# Altium project UZ_CarrierBoard.PrjPcb (part 8 of 10)

## Sheet S3C_IOs3V3.SchDoc
size A4; Organization: UltraZohm; SheetNumber: 9
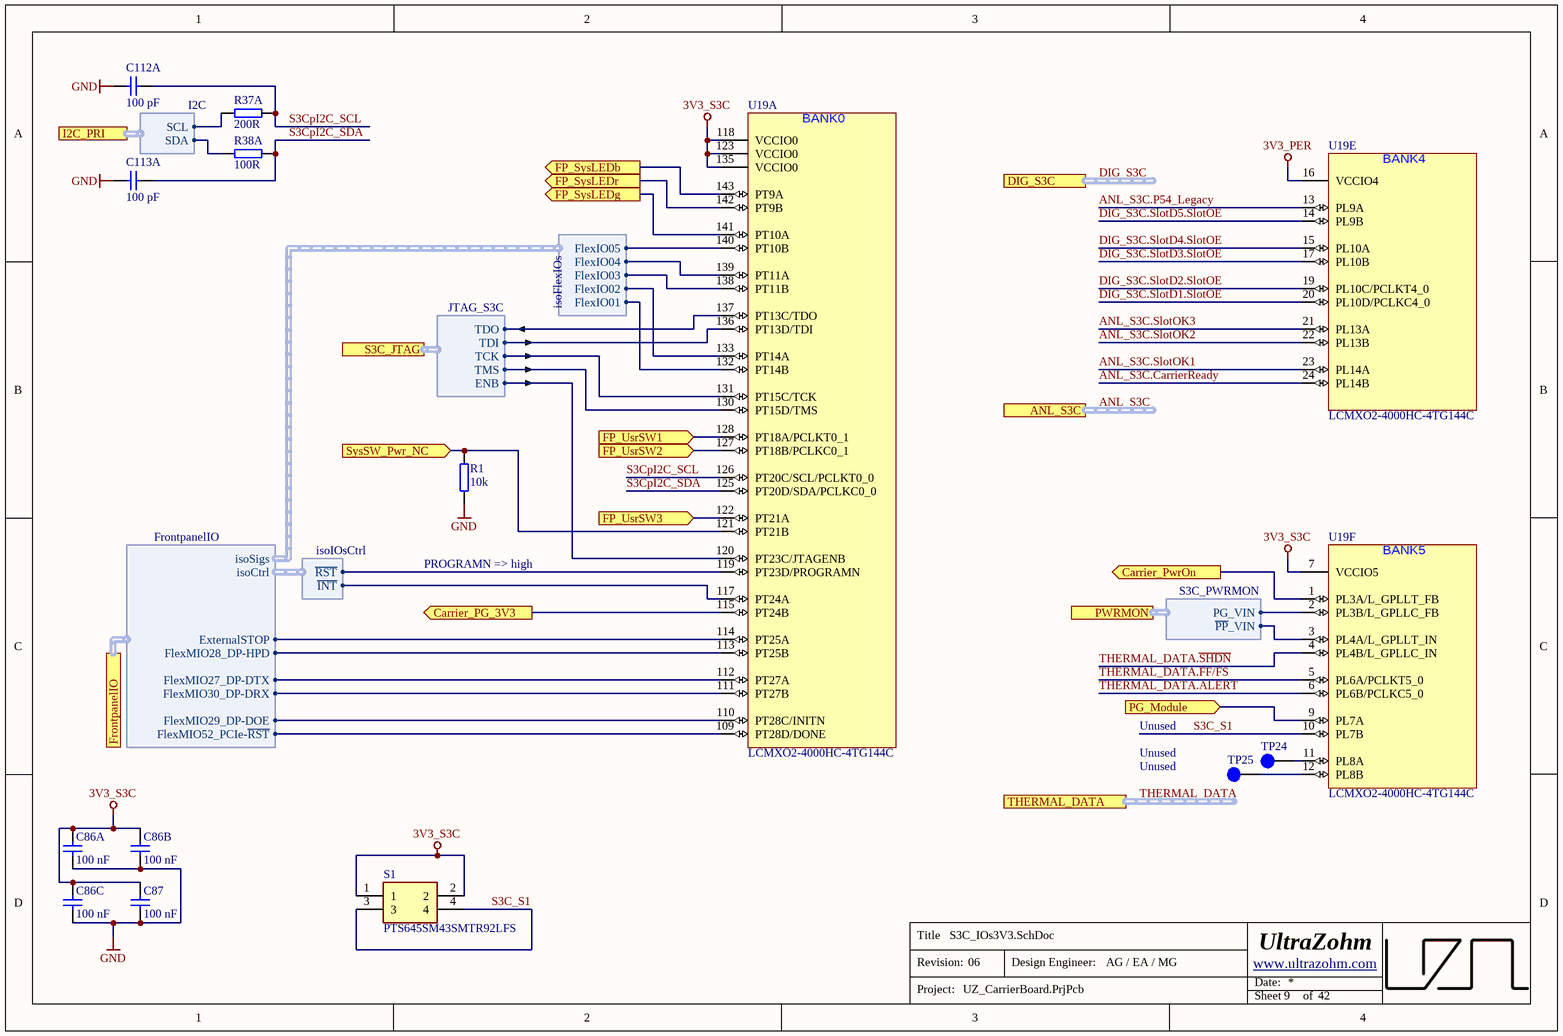
[diagram p29: S3C_IOs3V3.SchDoc]

### Parts
C86A  100 nF  [C_0603_TE]
C86B  100 nF  [C_0603_TE]
C86C  100 nF  [C_0603_TE]
C87  100 nF  [C_0603_TE]
C112A  100 pF  [C_0603_TE]
C113A  100 pF  [C_0603_TE]
R1  10k  [R_0603_TE]
R37A  200R  [R_0603_TE]
R38A  100R  [R_0603_TE]
S1  PTS645SM43SMTR92LFS  [PTS645_SMT]
TP24  Testpoint 1mm  [TP_1mm]  (value not drawn)  (no BOM)
TP25  Testpoint 1mm  [TP_1mm]  (value not drawn)  (no BOM)
U19  LCMXO2-4000HC-4TG144C  [QFP50P2200X2200X160-144N]  (parts A,E,F of 7)

### Ports
ANL_S3C (harness ANL_S3C), Carrier_PG_3V3 (out), Carrier_PwrOn (out), DIG_S3C (harness DIG_S3C), FP_SysLEDb (out), FP_SysLEDg (out), FP_SysLEDr (out), FP_UsrSW1 (in), FP_UsrSW2 (in), FP_UsrSW3 (in), FrontpanelIO (harness FrontpanelIO), I2C_PRI (harness I2C), PG_Module (in), PWRMON (harness S3C_PWRMON), S3C_JTAG (harness JTAG_S3C), SysSW_Pwr_NC (in), THERMAL_DATA (harness T_DATA)

### Harnesses
JTAG_S3C: TDO, TDI, TCK, TMS, ENB
I2C: SCL, SDA
FrontpanelIO: FlexMIO27_DP-DTX, FlexMIO28_DP-HPD, FlexMIO29_DP-DOE, FlexMIO30_DP-DRX, FlexMIO52_PCIe-~{RST}, isoSigs, isoCtrl, ExternalSTOP
isoFlexIOs: FlexIO01, FlexIO02, FlexIO03, FlexIO04, FlexIO05
isoIOsCtrl: ~{RST}, ~{INT}
S3C_PWRMON: PG_VIN, ~{PP}_VIN

### Nets
3V3_PER: U19.16(VCCIO4)
3V3_S3C: C86A.2 C86B.2 C86C.2 C87.2 S1.1 S1.2 U19.7(VCCIO5) U19.118(VCCIO0) U19.123(VCCIO0) U19.135(VCCIO0)
GND: C86A.1 C86B.1 C86C.1 C87.1 C112A.2 C113A.2 R1.1
ANL_S3C.CarrierReady: U19.24(PL14B)
ANL_S3C.P54_Legacy: U19.13(PL9A)
ANL_S3C.SlotOK1: U19.23(PL14A)
ANL_S3C.SlotOK2: U19.22(PL13B)
ANL_S3C.SlotOK3: U19.21(PL13A)
Carrier_PG_3V3: U19.115(PT24B) ; port Carrier_PG_3V3
Carrier_PwrOn: U19.1(PL3A/L_GPLLT_FB) ; port Carrier_PwrOn
DIG_S3C.SlotD1.SlotOE: U19.20(PL10D/PCLKC4_0)
DIG_S3C.SlotD2.SlotOE: U19.19(PL10C/PCLKT4_0)
DIG_S3C.SlotD3.SlotOE: U19.17(PL10B)
DIG_S3C.SlotD4.SlotOE: U19.15(PL10A)
DIG_S3C.SlotD5.SlotOE: U19.14(PL9B)
FP_SysLEDb: U19.143(PT9A) ; port FP_SysLEDb
FP_SysLEDg: U19.141(PT10A) ; port FP_SysLEDg
FP_SysLEDr: U19.142(PT9B) ; port FP_SysLEDr
FP_UsrSW1: U19.128(PT18A/PCLKT0_1) ; port FP_UsrSW1
FP_UsrSW2: U19.127(PT18B/PCLKC0_1) ; port FP_UsrSW2
FP_UsrSW3: U19.122(PT21A) ; port FP_UsrSW3
PG/~{ALERT}: U19.2(PL3B/L_GPLLC_FB) ; port PWRMON.PG_VIN
PG/~{ALERT}: U19.3(PL4A/L_GPLLT_IN) ; port PWRMON.~{PP}_VIN  [a separate net that carries the same name]
PG_Module: U19.9(PL7A) ; port PG_Module
S3C_S1: S1.3 S1.4 U19.10(PL7B)
S3CpI2C_SCL: C112A.1 R37A.2 U19.126(PT20C/SCL/PCLKT0_0)
S3CpI2C_SDA: C113A.1 R38A.2 U19.125(PT20D/SDA/PCLKC0_0)
SysSW_Pwr_NC: R1.2 U19.121(PT21B) ; port SysSW_Pwr_NC
THERMAL_DATA.~{ALERT}: U19.6(PL6B/PCLKC5_0)
THERMAL_DATA.~{FF/FS}: U19.5(PL6A/PCLKT5_0)
THERMAL_DATA.~{SHDN}: U19.4(PL4B/L_GPLLC_IN)
NetR37A_1: R37A.1 ; port I2C_PRI.SCL
NetR38A_1: R38A.1 ; port I2C_PRI.SDA
NetTP24_1: TP24.1 U19.11(PL8A)
NetTP25_1: TP25.1 U19.12(PL8B)
NetU19_114: U19.114(PT25A) ; port FrontpanelIO.ExternalSTOP
NetU19_117: U19.117(PT24A) ; harness isoIOsCtrl.~{INT}
NetU19_119: U19.119(PT23D/PROGRAMN) ; harness isoIOsCtrl.~{RST}
NetU19_120: U19.120(PT23C/JTAGENB) ; port S3C_JTAG.ENB
NetU19_130: U19.130(PT15D/TMS) ; port S3C_JTAG.TMS
NetU19_131: U19.131(PT15C/TCK) ; port S3C_JTAG.TCK
NetU19_132: U19.132(PT14B) ; harness isoFlexIOs.FlexIO01
NetU19_133: U19.133(PT14A) ; harness isoFlexIOs.FlexIO02
NetU19_136: U19.136(PT13D/TDI) ; port S3C_JTAG.TDI
NetU19_137: U19.137(PT13C/TDO) ; port S3C_JTAG.TDO
NetU19_138: U19.138(PT11B) ; harness isoFlexIOs.FlexIO03
NetU19_139: U19.139(PT11A) ; harness isoFlexIOs.FlexIO04
NetU19_140: U19.140(PT10B) ; harness isoFlexIOs.FlexIO05

Not connected (* = marked no-connect by the designer): U19 109(PT28D/DONE) 110(PT28C/INITN) 111(PT27B) 112(PT27A) 113(PT25B)

### Buses and harness runs
harness ANL_S3C = port ANL_S3C
harness DIG_S3C = port DIG_S3C
harness THERMAL_DATA = port THERMAL_DATA

### Notes on the sheet
- PROGRAMN => high
- Unused
- Title
- Revision:
- Design Engineer:
- Date:
- Project:
- Sheet
- of
- (in symbol LCMXO2-4000HC-4TG144C, part A) BANK0
- (in symbol LCMXO2-4000HC-4TG144C, part E) BANK4
- (in symbol LCMXO2-4000HC-4TG144C, part F) BANK5

### Library data of the parts
C86A C86B C86C C87 = UZgen_C_0603_100nF_50V_X7R: as C103 on sheet S3C; Value: 100 nF; Technology: X7R; Manufacturer Part Number: UZgen_C_0603_100nF_50V_X7R; PartID: 1; Created On: 02/07/2024 14:42:23; Device Package: 0603; Mounting Type: SMD; Last Updated: 02/08/2024 14:45:57
C112A C113A = UZgen_C_0603_100pF_50V_X7R: Generic capacitor; Manufacturer: UZgen; Voltage: 50V; Tolerance: 10 %; Created from: UZgenTool; Manufacturer Part Number: UZgen_C_0603_100pF_50V_X7R; PartID: 4215; Created On: 02/08/2024 11:18:08; Value: 100 pF; Device Package: 0603; Technology: X7R; Mounting Type: SMD; Last Updated: 02/08/2024 11:18:08
R1 = UZgen_R_0603_10k: as R200 on sheet Power_Supply_TPS54260; Manufacturer Part Number: UZgen_R_0603_10k; PartID: 1; Created On: 02/07/2024 14:34:53; Value: 10k; Device Package: 0603; Mounting Type: SMD; Last Updated: 02/07/2024 14:37:16
R37A = UZgen_R_0603_200R: Generic resistor; Manufacturer: UZgen; Tolerance: 1 %; Created from: UZgenTool; Manufacturer Part Number: UZgen_R_0603_200R; PartID: 204; Created On: 02/07/2024 17:29:49; Value: 200R; Device Package: 0603; Mounting Type: SMD; Last Updated: 02/07/2024 17:29:49
R38A = UZgen_R_0603_100R: as R91 on sheet Power_Supply_1; Manufacturer Part Number: UZgen_R_0603_100R; PartID: 197; Created On: 02/07/2024 17:29:48; Value: 100R; Device Package: 0603; Mounting Type: SMD; Last Updated: 02/07/2024 17:29:48
S1 = PTS645SM43SMTR92LFS: 50mA SPST 160gf 12V SMD-4P,6x6mm Tactile Switches ROHS; Manufacturer_Name: C & K COMPONENTS; Manufacturer: C&K COMPONENTS; Value: Push Button; Created from: AGeiger; Datasheet Link: https://www.ckswitches.com/media/1471/pts645.pdf; Manufacturer_Part_Number: PTS645SM43SMTR92LFS; Mouser Part Number: 611-PTS645SM43SMTR92; Mouser Price/Stock: https://www.mouser.co.uk/ProductDetail/CK/PTS645SM43SMTR92LFS?qs=FESYatJ8odKPktxv6ncfWg%3D%3D; Arrow Part Number: PTS645SM43SMTR92LFS; Arrow Price/Stock: https://www.arrow.com/en/products/pts645sm43smtr92lfs/ck; Manufacturer Part Number: PTS645SM43SMTR92LFS; PartID: 24; Created On: 31/05/2023 15:31:02; ComponentLink1Description: Datasheet; ComponentLink1URL: https://datasheet.lcsc.com/lcsc/1810121628_C-K-PTS645SM43SMTR92LFS_C221880.pdf; Component Type: Tactile Switch; Device Package: SMD; Last Updated: 31/05/2023 15:31:02; Mounting Type: SMD; Operating Temperature: -20 to +60 °C; Supplier 1: Mouser; Supplier Part Number 1: 611-PTS645SM43SMTR92; Supplier 2: LCSC; Supplier Part Number 2: C221880; Type: Tactile Switch; Live Cycle Status: 1; LCSC Part Number: C221880
TP24 TP25 = NULL: as TP78 on sheet Power_Supply_TPS54260; Created: 2018_06_25_AGeiger; Value: Testpoint 1mm; PartID: 9; Created On: 20/09/2022 13:14:57; Component Type: Testpoint; Last Updated: 20/09/2022 13:15:39; Manufacturer: NULL; Supplier 1: NULL; Supplier Part Number 1: NULL; Type: Testpoint; Live Cycle Status: 1
U19 = LCMXO2-4000HC-4TG144C: as U19 on sheet S3C; Manufacturer Part Number: LCMXO2-4000HC-4TG144C; PartID: 38; Created On: 03/07/2024 17:33:36; ComponentLink1Description: Datasheet; ComponentLink1URL: https://wmsc.lcsc.com/wmsc/upload/file/pdf/v2/lcsc/2403111456_Lattice-LCMXO2-4000HC-4TG144C_C1521625.pdf; Component Type: CPLD; Device Package: TQFP-144; Last Updated: 23/08/2024 11:42:29; Mounting Type: SMD; Operating Temperature: -0 to +85 °C; Supplier 1: LCSC; Supplier Part Number 1: C1521625; Supplier 2: Mouser; Supplier Part Number 2: 842-XO24000HC4TG144C; Type: CPLD; Live Cycle Status: 1; LCSC Part Number: C1521625; Stock number: not stored

## Sheet S3C_IOs1V8.SchDoc
size A4; Organization: UltraZohm; SheetNumber: 10
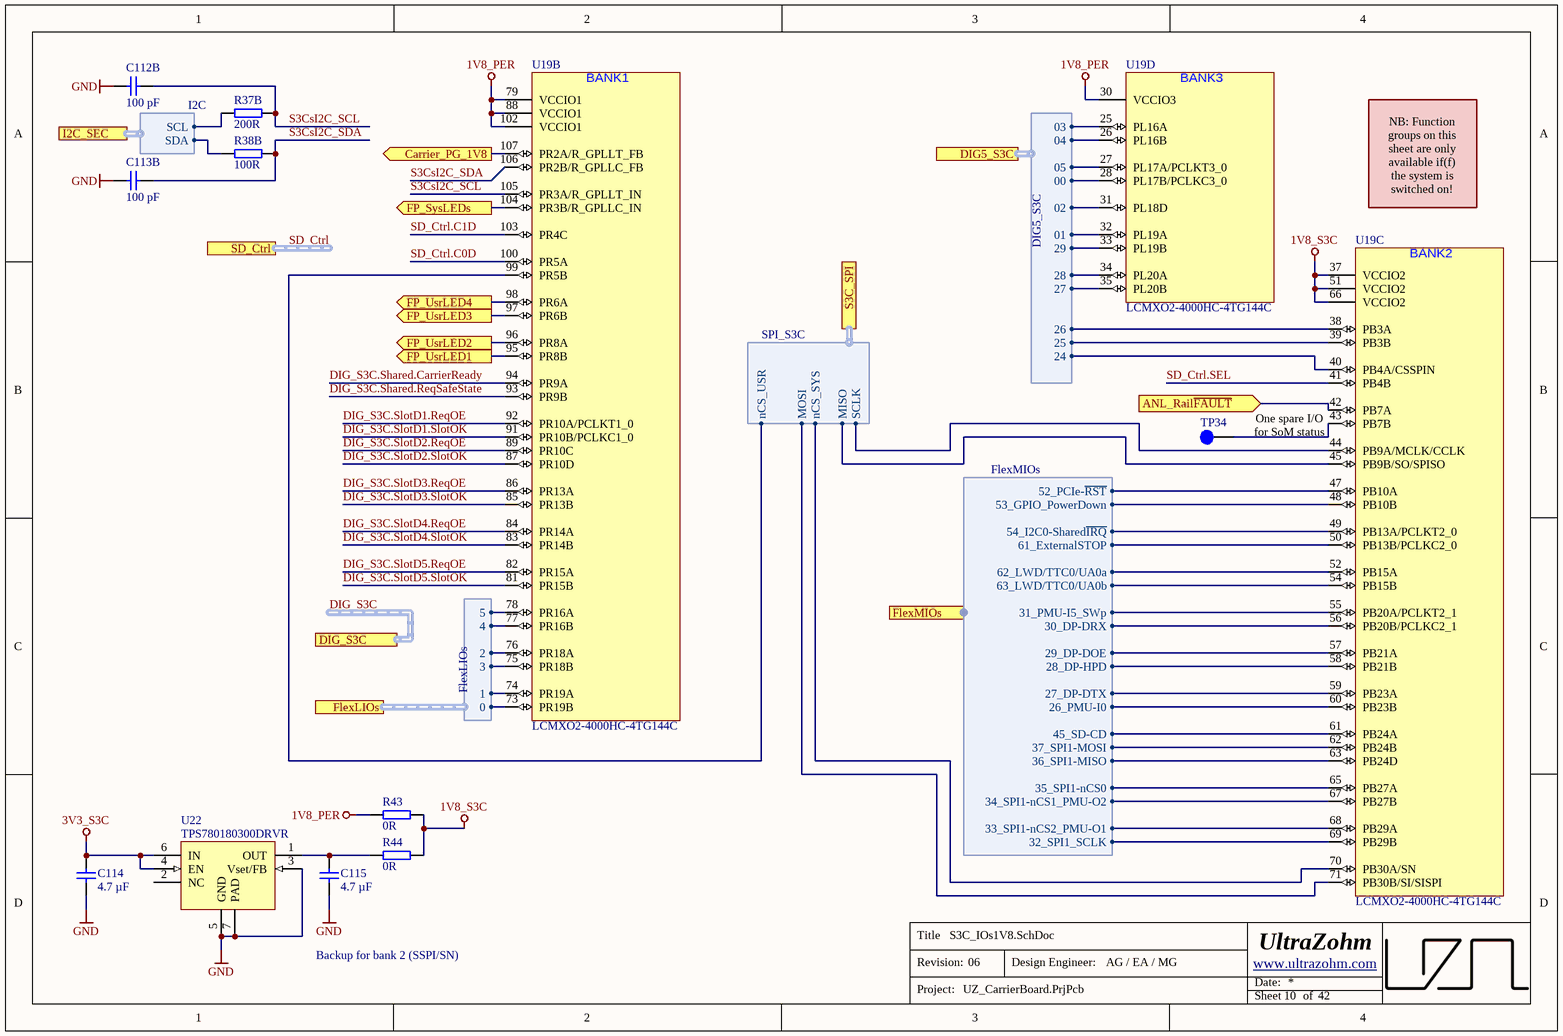
[diagram p30: S3C_IOs1V8.SchDoc]

### Parts
C112B  100 pF  [C_0603_TE]
C113B  100 pF  [C_0603_TE]
C114  4.7 µF  [C_0603_TE]
C115  4.7 µF  [C_0603_TE]
R37B  200R  [R_0603_TE]
R38B  100R  [R_0603_TE]
R43  0R  [R_1206_TE]
R44  0R  [R_1206_TE]
TP34  Testpoint 1mm  [TP_1mm]  (value not drawn)  (no BOM)
U19  LCMXO2-4000HC-4TG144C  [QFP50P2200X2200X160-144N]  (parts B,C,D of 7)
U22  TPS780180300DRVR  [SON65P200X200X80-7N]

### Ports
ANL_Rail~{FAULT} (in), Carrier_PG_1V8 (out), DIG5_S3C (harness DIG5_S3C), DIG_S3C (harness DIG_S3C), FlexLIOs (harness FlexLIOs), FlexMIOs (harness FlexMIOs), FP_SysLEDs (out), FP_UsrLED1 (out), FP_UsrLED2 (out), FP_UsrLED3 (out), FP_UsrLED4 (out), I2C_SEC (harness I2C), S3C_SPI (harness SPI_S3C), SD_Ctrl (harness SD_Ctrl)

### Harnesses
FlexMIOs: 26_PMU-I0, 27_DP-DTX, 28_DP-HPD, 29_DP-DOE, 30_DP-DRX, 31_PMU-I5_SWp, 32_SPI1_SCLK, 33_SPI1-nCS2_PMU-O1, 34_SPI1-nCS1_PMU-O2, 35_SPI1-nCS0, 36_SPI1-MISO, 37_SPI1-MOSI, 45_SD-CD, 52_PCIe-~{RST}, 53_GPIO_PowerDown, 54_I2C0-Shared~{IRQ}, 61_ExternalSTOP, 62_LWD/TTC0/UA0a, 63_LWD/TTC0/UA0b
DIG5_S3C: 00, 01, 02, 03, 04, 05, 24, 25, 26, 27, 28, 29
I2C: SCL, SDA
SPI_S3C: SCLK, MOSI, MISO, nCS_SYS, nCS_USR
FlexLIOs: 0, 1, 2, 3, 4, 5

### Nets
1V8_PER: R43.1 U19.30(VCCIO3) U19.79(VCCIO1) U19.88(VCCIO1) U19.102(VCCIO1)
1V8_S3C: R43.2 R44.2 U19.37(VCCIO2) U19.51(VCCIO2) U19.66(VCCIO2)
3V3_S3C: C114.2 U22.4(EN) U22.6(IN)
GND: C112B.2 C113B.2 C114.1 C115.1 U22.3(Vset/FB) U22.5(GND) U22.7(PAD)
ANL_Rail~{FAULT}: U19.42(PB7A) ; port ANL_Rail~{FAULT}
B64_T0: U19.73(PR19B) ; port FlexLIOs.0
B64_T1: U19.74(PR19A) ; port FlexLIOs.1
B64_T2: U19.76(PR18A) ; port FlexLIOs.2
B64_T3: U19.75(PR18B) ; port FlexLIOs.3
B66_L23_N: U19.78(PR16A) ; port FlexLIOs.5
B66_L23_P: U19.77(PR16B) ; port FlexLIOs.4
Carrier_PG_1V8: U19.107(PR2A/R_GPLLT_FB) ; port Carrier_PG_1V8
DIG_00_Ch5: U19.28(PL17B/PCLKC3_0) ; port DIG5_S3C.00
DIG_01_Ch5: U19.32(PL19A) ; port DIG5_S3C.01
DIG_02_Ch5: U19.31(PL18D) ; port DIG5_S3C.02
DIG_03_Ch5: U19.25(PL16A) ; port DIG5_S3C.03
DIG_04_Ch5: U19.26(PL16B) ; port DIG5_S3C.04
DIG_05_Ch5: U19.27(PL17A/PCLKT3_0) ; port DIG5_S3C.05
DIG_24_Ch5: U19.40(PB4A/CSSPIN) ; port DIG5_S3C.24
DIG_25_Ch5: U19.39(PB3B) ; port DIG5_S3C.25
DIG_26_Ch5: U19.38(PB3A) ; port DIG5_S3C.26
DIG_27_Ch5: U19.35(PL20B) ; port DIG5_S3C.27
DIG_28_Ch5: U19.34(PL20A) ; port DIG5_S3C.28
DIG_29_Ch5: U19.33(PL19B) ; port DIG5_S3C.29
DIG_S3C.Shared.CarrierReady: U19.94(PR9A)
DIG_S3C.Shared.ReqSafeState: U19.93(PR9B)
DIG_S3C.SlotD1.ReqOE: U19.92(PR10A/PCLKT1_0)
DIG_S3C.SlotD1.SlotOK: U19.91(PR10B/PCLKC1_0)
DIG_S3C.SlotD2.ReqOE: U19.89(PR10C)
DIG_S3C.SlotD2.SlotOK: U19.87(PR10D)
DIG_S3C.SlotD3.ReqOE: U19.86(PR13A)
DIG_S3C.SlotD3.SlotOK: U19.85(PR13B)
DIG_S3C.SlotD4.ReqOE: U19.84(PR14A)
DIG_S3C.SlotD4.SlotOK: U19.83(PR14B)
DIG_S3C.SlotD5.ReqOE: U19.82(PR15A)
DIG_S3C.SlotD5.SlotOK: U19.81(PR15B)
FlexMIOs.26_PMU-I0: U19.60(PB23B) ; port FlexMIOs.26_PMU-I0
FlexMIOs.27_DP-DTX: U19.59(PB23A) ; port FlexMIOs.27_DP-DTX
FlexMIOs.28_DP-HPD: U19.58(PB21B) ; port FlexMIOs.28_DP-HPD
FlexMIOs.29_DP-DOE: U19.57(PB21A) ; port FlexMIOs.29_DP-DOE
FlexMIOs.30_DP-DRX: U19.56(PB20B/PCLKC2_1) ; port FlexMIOs.30_DP-DRX
FlexMIOs.31_PMU-I5_SWp: U19.55(PB20A/PCLKT2_1) ; port FlexMIOs.31_PMU-I5_SWp
FlexMIOs.32_SPI1_SCLK: U19.69(PB29B) ; port FlexMIOs.32_SPI1_SCLK
FlexMIOs.33_SPI1-nCS2_PMU-O1: U19.68(PB29A) ; port FlexMIOs.33_SPI1-nCS2_PMU-O1
FlexMIOs.34_SPI1-nCS1_PMU-O2: U19.67(PB27B) ; port FlexMIOs.34_SPI1-nCS1_PMU-O2
FlexMIOs.35_SPI1-nCS0: U19.65(PB27A) ; port FlexMIOs.35_SPI1-nCS0
FlexMIOs.36_SPI1-MISO: U19.63(PB24D) ; port FlexMIOs.36_SPI1-MISO
FlexMIOs.37_SPI1-MOSI: U19.62(PB24B) ; port FlexMIOs.37_SPI1-MOSI
FlexMIOs.45_SD-CD: U19.61(PB24A) ; port FlexMIOs.45_SD-CD
FlexMIOs.52_PCIe-~{RST}: U19.47(PB10A) ; port FlexMIOs.52_PCIe-~{RST}
FlexMIOs.53_GPIO_PowerDown: U19.48(PB10B) ; port FlexMIOs.53_GPIO_PowerDown
FlexMIOs.54_I2C0-Shared~{IRQ}: U19.49(PB13A/PCLKT2_0) ; port FlexMIOs.54_I2C0-Shared~{IRQ}
FlexMIOs.61_ExternalSTOP: U19.50(PB13B/PCLKC2_0) ; port FlexMIOs.61_ExternalSTOP
FlexMIOs.62_LWD/TTC0/UA0a: U19.52(PB15A) ; port FlexMIOs.62_LWD/TTC0/UA0a
FlexMIOs.63_LWD/TTC0/UA0b: U19.54(PB15B) ; port FlexMIOs.63_LWD/TTC0/UA0b
FP_SysLEDs: U19.104(PR3B/R_GPLLC_IN) ; port FP_SysLEDs
FP_UsrLED1: U19.95(PR8B) ; port FP_UsrLED1
FP_UsrLED2: U19.96(PR8A) ; port FP_UsrLED2
FP_UsrLED3: U19.97(PR6B) ; port FP_UsrLED3
FP_UsrLED4: U19.98(PR6A) ; port FP_UsrLED4
PS_SPI0.CLK: U19.44(PB9A/MCLK/CCLK) ; port S3C_SPI.SCLK
PS_SPI0.MISO: U19.45(PB9B/SO/SPISO) ; port S3C_SPI.MISO
PS_SPI0.MOSI: U19.71(PB30B/SI/SISPI) ; port S3C_SPI.MOSI
S3CsI2C_SCL: C112B.1 R37B.2 U19.105(PR3A/R_GPLLT_IN)
S3CsI2C_SDA: C113B.1 R38B.2 U19.106(PR2B/R_GPLLC_FB)
SD_Ctrl.C0D: U19.100(PR5A)
SD_Ctrl.C1D: U19.103(PR4C)
SD_Ctrl.SEL: U19.41(PB4B)
NetC115_2: C115.2 R44.1 U22.1(OUT)
NetR37_2: R37B.1 ; port I2C_SEC.SCL
NetR38_2: R38B.1 ; port I2C_SEC.SDA
NetTP34_1: TP34.1 U19.43(PB7B)
NetU19_70: U19.70(PB30A/SN) ; port S3C_SPI.nCS_SYS
NetU19_99: U19.99(PR5B) ; port S3C_SPI.nCS_USR

Not connected (* = marked no-connect by the designer): U22 2(NC)

### Buses and harness runs
harness DIG_S3C = port DIG_S3C
harness SD_Ctrl = port SD_Ctrl

### Notes on the sheet
- NB: Function groups on this sheet are only available if(f) the system is switched on!
- One spare I/O
  for SoM status
- Backup for bank 2 (SSPI/SN)
- Title
- Revision:
- Design Engineer:
- Date:
- Project:
- Sheet
- of
- (in symbol LCMXO2-4000HC-4TG144C, part B) BANK1
- (in symbol LCMXO2-4000HC-4TG144C, part C) BANK2
- (in symbol LCMXO2-4000HC-4TG144C, part D) BANK3

### Library data of the parts
C112B C113B = UZgen_C_0603_100pF_50V_X7R: as C112A on sheet S3C_IOs3V3; Manufacturer Part Number: UZgen_C_0603_100pF_50V_X7R; PartID: 4215; Created On: 02/08/2024 11:18:08; Value: 100 pF; Device Package: 0603; Technology: X7R; Mounting Type: SMD; Last Updated: 02/08/2024 11:18:08
C114 C115 = UZgen_C_0603_4.7uF_16V_X5R: Generic capacitor; Manufacturer: UZgen; Voltage: 16V; Tolerance: 10 %; Created from: MGeier; Manufacturer Part Number: UZgen_C_0603_4.7uF_16V_X5R; PartID: 5809; Created On: 20/03/2025 14:43:45; Value: 4.7 µF; Device Package: 0603; Technology: X5R; Mounting Type: SMD; Last Updated: 20/03/2025 14:43:45
R37B = UZgen_R_0603_200R: as R37A on sheet S3C_IOs3V3; Manufacturer Part Number: UZgen_R_0603_200R; PartID: 204; Created On: 02/07/2024 17:29:49; Value: 200R; Device Package: 0603; Mounting Type: SMD; Last Updated: 02/07/2024 17:29:49
R38B = UZgen_R_0603_100R: as R91 on sheet Power_Supply_1; Manufacturer Part Number: UZgen_R_0603_100R; PartID: 197; Created On: 02/07/2024 17:29:48; Value: 100R; Device Package: 0603; Mounting Type: SMD; Last Updated: 02/07/2024 17:29:48
R43 R44 = UZgen_R_1206_0R: as R221-R224 on sheet Power_Supply_1; Manufacturer Part Number: UZgen_R_1206_0R; PartID: 583; Created On: 08/07/2024 14:34:30; Value: 0R; Device Package: 1206; Mounting Type: SMD; Last Updated: 08/07/2024 14:34:30
TP34 = NULL: as TP78 on sheet Power_Supply_TPS54260; Created: 2018_06_25_AGeiger; Value: Testpoint 1mm; PartID: 9; Created On: 20/09/2022 13:14:57; Component Type: Testpoint; Last Updated: 20/09/2022 13:15:39; Manufacturer: NULL; Supplier 1: NULL; Supplier Part Number 1: NULL; Type: Testpoint; Live Cycle Status: 1
U19 = LCMXO2-4000HC-4TG144C: as U19 on sheet S3C; Manufacturer Part Number: LCMXO2-4000HC-4TG144C; PartID: 38; Created On: 03/07/2024 17:33:36; ComponentLink1Description: Datasheet; ComponentLink1URL: https://wmsc.lcsc.com/wmsc/upload/file/pdf/v2/lcsc/2403111456_Lattice-LCMXO2-4000HC-4TG144C_C1521625.pdf; Component Type: CPLD; Device Package: TQFP-144; Last Updated: 23/08/2024 11:42:29; Mounting Type: SMD; Operating Temperature: -0 to +85 °C; Supplier 1: LCSC; Supplier Part Number 1: C1521625; Supplier 2: Mouser; Supplier Part Number 2: 842-XO24000HC4TG144C; Type: CPLD; Live Cycle Status: 1; LCSC Part Number: C1521625; Stock number: not stored
U22 = TPS780180300DRVR: LDO Voltage Regulators 150mA,LDO Reg,Ultra Low Pwr; Manufacturer: Texas Instruments; Value: 1.8 V, 3 V; Created from: FRosner; Manufacturer Part Number: TPS780180300DRVR; PartID: 17; Created On: 02/07/2024 16:16:00; ComponentLink1Description: Datasheet; ComponentLink1URL: https://wmsc.lcsc.com/wmsc/upload/file/pdf/v2/lcsc/2302220830_Texas-Instruments-TPS780180300DRVR_C2860011.pdf; Component Type: LDO; Device Package: SMD; Last Updated: 03/09/2024 16:21:15; Mounting Type: SMD; Operating Temperature: -40 to +125 °C; Series: TPS780; Supplier 1: Mouser; Supplier Part Number 1: 595-TPS780180300DRVR; Supplier 2: LCSC; Supplier Part Number 2: C2860011; Type: LDO; Live Cycle Status: 1; LCSC Part Number: C2860011; Stock number: not stored

## Sheet S3C_SplitSPI.SchDoc
size A4; Organization: UltraZohm; SheetNumber: 12
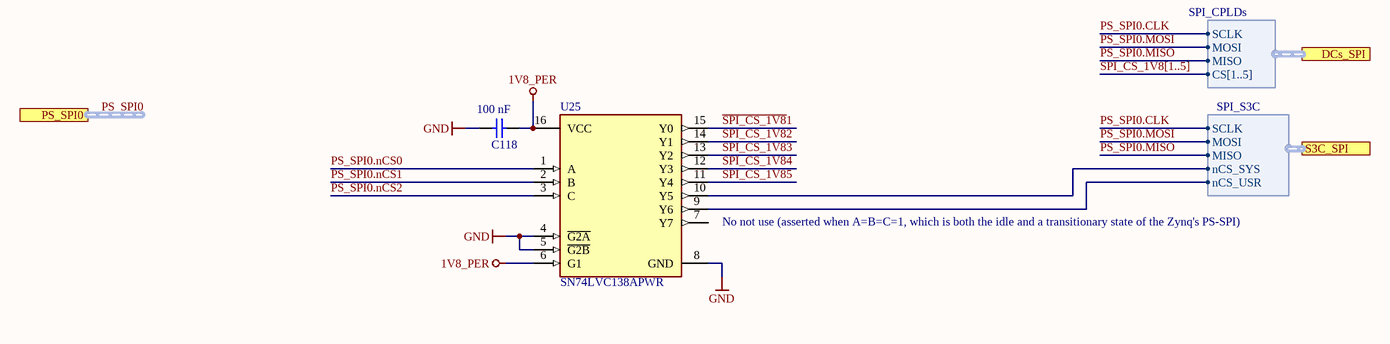
[diagram p31: S3C_SplitSPI.SchDoc]

### Parts
C118  100 nF  [C_0603_TE]
U25  SN74LVC138APWR  [TSSOP-16]

### Ports
DCs_SPI (harness SPI_CPLDs), PS_SPI0 (harness SPI), S3C_SPI (harness SPI_S3C)

### Harnesses
SPI_CPLDs: SCLK, MOSI, MISO, CS[1..5]
SPI_S3C: SCLK, MOSI, MISO, nCS_SYS, nCS_USR

### Nets
1V8_PER: C118.2 U25.6(G1) U25.16(VCC)
GND: C118.1 U25.4(~{G2A}) U25.5(~{G2B}) U25.8(GND)
PS_SPI0.CLK: port DCs_SPI.SCLK, port S3C_SPI.SCLK
PS_SPI0.MISO: port DCs_SPI.MISO, port S3C_SPI.MISO
PS_SPI0.MOSI: port DCs_SPI.MOSI, port S3C_SPI.MOSI
PS_SPI0.nCS0: U25.1(A)
PS_SPI0.nCS1: U25.2(B)
PS_SPI0.nCS2: U25.3(C)
~{SPI_CS_1V8}1: U25.15(Y0)
~{SPI_CS_1V8}2: U25.14(Y1)
~{SPI_CS_1V8}3: U25.13(Y2)
~{SPI_CS_1V8}4: U25.12(Y3)
~{SPI_CS_1V8}5: U25.11(Y4)
NetU19_70: U25.10(Y5) ; port S3C_SPI.nCS_SYS
NetU19_99: U25.9(Y6) ; port S3C_SPI.nCS_USR

Not connected (* = marked no-connect by the designer): U25 7(Y7)

### Buses and harness runs
bus ~{SPI_CS_1V8}[1..5]
harness PS_SPI0 = port PS_SPI0

### Notes on the sheet
- (near U25) No not use (asserted when A=B=C=1, which is both the idle and a transitionary state of the Zynq's PS-SPI)
- Title
- Revision:
- Design Engineer:
- Date:
- Project:
- Sheet
- of

### Library data of the parts
C118 = UZgen_C_0603_100nF_50V_X7R: Generic capacitor; Manufacturer: UZgen; Voltage: 50V; Tolerance: 10 %; Created from: AGeiger; Manufacturer Part Number: UZgen_C_0603_100nF_50V_X7R; PartID: 1; Created On: 02/07/2024 14:42:23; Value: 100 nF; Device Package: 0603; Technology: X7R; Mounting Type: SMD; Last Updated: 08/08/2024 15:01:15
U25 = SN74LVC138APWR: 3-Line to 8-Line Decoders Demultiplexers; Manufacturer: Texas Instruments; Created from: FRosner; ComponentLink2Description: Datasheet; ComponentLink2URL: http://www.ti.com/lit/ds/symlink/sn74lvc138a.pdf; Manufacturer Part Number: SN74LVC138APWR; PartID: 19; Created On: 05/09/2024 11:52:28; ComponentLink1Description: Datasheet; ComponentLink1URL: https://www.ti.com/lit/ds/symlink/sn74lvc138a.pdf?ts=1725532939575&ref_url=https%253A%252F%252Fwww.mouser.de%252F; Component Type: Decoders/Demultiplexers; Device Package: TSSOP-16; Last Updated: 05/09/2024 12:52:22; Mounting Type: SMD; Operating Temperature: -40 - 85 °C; Series: SN74LVC138A; Supplier 1: Mouser; Supplier Part Number 1: 595-SN74LVC138APWR; Supplier 2: LCSC; Supplier Part Number 2: C485077; Type: Decoders/Demultiplexers; Live Cycle Status: 1; LCSC Part Number: C485077; Stock number: not stored

## Sheet S3C_FrontpanelInterface.SchDoc
size A4; Organization: UltraZohm; SheetNumber: 13
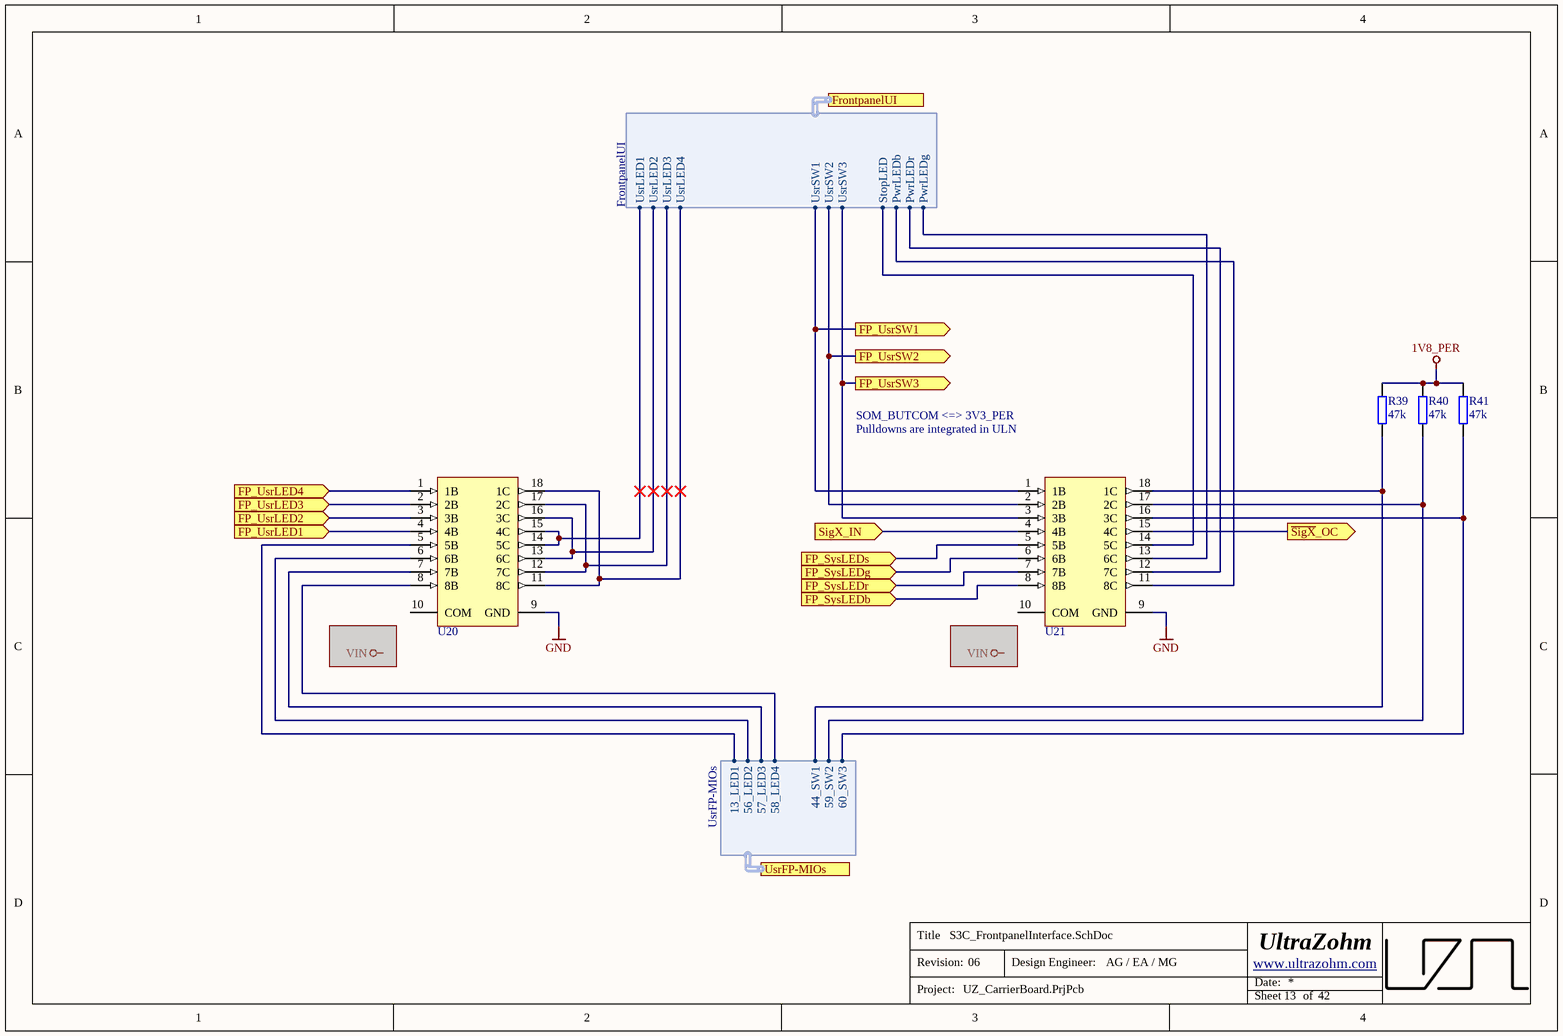
[diagram p32: S3C_FrontpanelInterface.SchDoc]

### Parts
R39  47k  [R_0603_TE]
R40  47k  [R_0603_TE]
R41  47k  [R_0603_TE]
U20  ULN2803A  [FP-SOICW-18LD-PL-1-IPC_B]  (value not drawn)
U21  ULN2803A  [FP-SOICW-18LD-PL-1-IPC_B]  (value not drawn)

### Ports
FP_SysLEDb (in), FP_SysLEDg (in), FP_SysLEDr (in), FP_SysLEDs (in), FP_UsrLED1 (in), FP_UsrLED2 (in), FP_UsrLED3 (in), FP_UsrLED4 (in), FP_UsrSW1 (out), FP_UsrSW2 (out), FP_UsrSW3 (out), FrontpanelUI (harness FrontpanelUI), SigX_IN (in), UsrFP-MIOs (harness UsrFP-MIOs), ~{SigX}_OC (out)

### Harnesses
UsrFP-MIOs: 13_LED1, 44_SW1, 56_LED2, 57_LED3, 58_LED4, 59_SW2, 60_SW3
FrontpanelUI: UsrLED1, UsrLED2, UsrLED3, UsrLED4, UsrSW1, UsrSW2, UsrSW3, StopLED, PwrLEDb, PwrLEDr, PwrLEDg

### Nets
1V8_PER: R39.2 R40.2 R41.2
5V_PER: U21.4(4B) ; port SigX_IN
GND: U20.9(GND) U21.9(GND)
FP_SysLEDb: U21.8(8B) ; port FP_SysLEDb
FP_SysLEDg: U21.6(6B) ; port FP_SysLEDg
FP_SysLEDr: U21.7(7B) ; port FP_SysLEDr
FP_SysLEDs: U21.5(5B) ; port FP_SysLEDs
FP_UsrLED1: U20.4(4B) ; port FP_UsrLED1
FP_UsrLED2: U20.3(3B) ; port FP_UsrLED2
FP_UsrLED3: U20.2(2B) ; port FP_UsrLED3
FP_UsrLED4: U20.1(1B) ; port FP_UsrLED4
FP_UsrSW1: U21.1(1B) ; port FP_UsrSW1, port FrontpanelUI.UsrSW1
FP_UsrSW2: U21.2(2B) ; port FP_UsrSW2, port FrontpanelUI.UsrSW2
FP_UsrSW3: U21.3(3B) ; port FP_UsrSW3, port FrontpanelUI.UsrSW3
JTAGEN_S3C~{DCs}: U21.15(4C) ; port ~{SigX}_OC
UsrFP-MIOs.13_LED1: U20.5(5B) ; port UsrFP-MIOs.13_LED1
UsrFP-MIOs.44_SW1: R39.1 U21.18(1C) ; port UsrFP-MIOs.44_SW1
UsrFP-MIOs.56_LED2: U20.6(6B) ; port UsrFP-MIOs.56_LED2
UsrFP-MIOs.57_LED3: U20.7(7B) ; port UsrFP-MIOs.57_LED3
UsrFP-MIOs.58_LED4: U20.8(8B) ; port UsrFP-MIOs.58_LED4
UsrFP-MIOs.59_SW2: R40.1 U21.17(2C) ; port UsrFP-MIOs.59_SW2
UsrFP-MIOs.60_SW3: R41.1 U21.16(3C) ; port UsrFP-MIOs.60_SW3
NetU20_11: U20.11(8C) U20.18(1C) ; port FrontpanelUI.UsrLED4
NetU20_12: U20.12(7C) U20.17(2C) ; port FrontpanelUI.UsrLED3
NetU20_13: U20.13(6C) U20.16(3C) ; port FrontpanelUI.UsrLED2
NetU20_14: U20.14(5C) U20.15(4C) ; port FrontpanelUI.UsrLED1
NetU21_11: U21.11(8C) ; port FrontpanelUI.PwrLEDb
NetU21_12: U21.12(7C) ; port FrontpanelUI.PwrLEDr
NetU21_13: U21.13(6C) ; port FrontpanelUI.PwrLEDg
NetU21_14: U21.14(5C) ; port FrontpanelUI.StopLED

Not connected (* = marked no-connect by the designer): U20 10(COM); U21 10(COM)

### Notes on the sheet
- SOM_BUTCOM <=> 3V3_PER
- Pulldowns are integrated in ULN
- Title
- Revision:
- Design Engineer:
- Date:
- Project:
- Sheet
- of

### Library data of the parts
R39-R41 = UZgen_R_0603_47k: as R172 on sheet Power_Supply_Input; Manufacturer Part Number: UZgen_R_0603_47k; PartID: 260; Created On: 02/07/2024 17:29:50; Value: 47k; Device Package: 0603; Mounting Type: SMD; Last Updated: 02/07/2024 17:29:50
U20 U21 = ULN2803A: Darlington Transistors Eight NPN Array; Manufacturer: UMW(Youtai Semiconductor Co., Ltd.); Created from: FRosner; Manufacturer Part Number: ULN2803A; PartID: 17; Created On: 13/06/2024 09:08:03; ComponentLink1Description: Datasheet; ComponentLink1URL: https://wmsc.lcsc.com/wmsc/upload/file/pdf/v2/lcsc/2311091738_UMW-Youtai-Semiconductor-Co---Ltd--ULN2803A_C845537.pdf; Component Type: Darlington Driver; Device Package: SOP-18; Last Updated: 04/09/2024 11:48:15; Mounting Type: SMT; Operating Temperature: -40~85 °C; Series: ULN2803A; Supplier 1: LCSC; Supplier Part Number 1: C845537; Type: Driver; Live Cycle Status: 1; LCSC Part Number: C845537

## Sheet Block_Diagram_Safety.SchDoc
size A4; Organization: UltraZohm; SheetNumber: 42
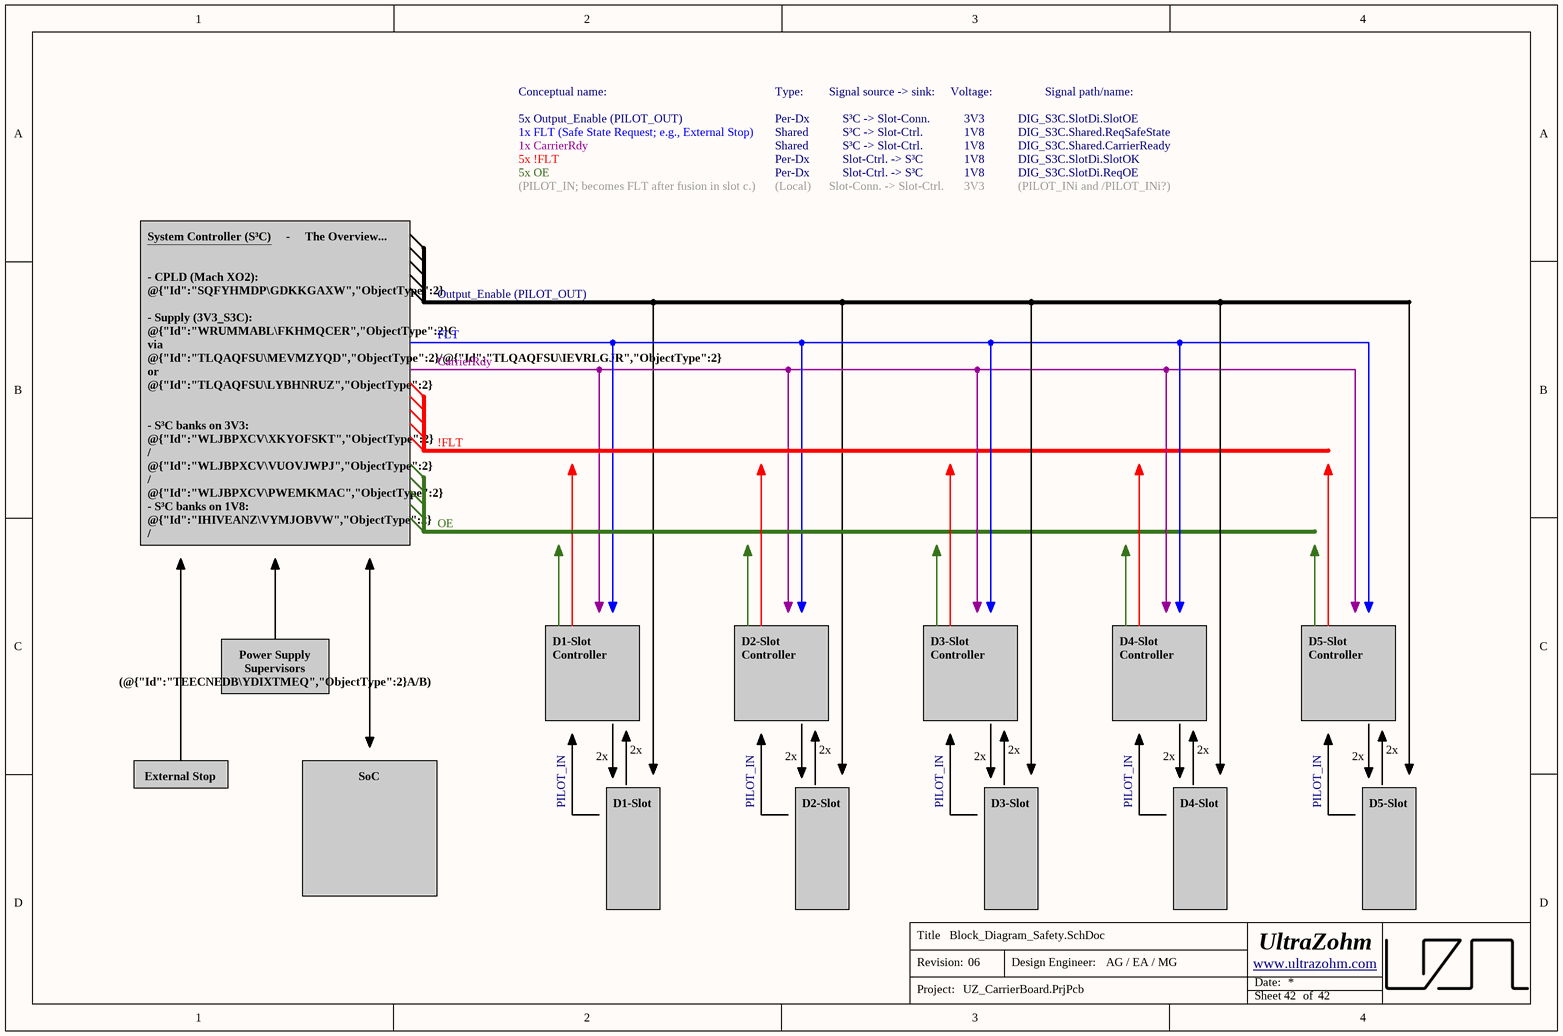
[diagram p33: Block_Diagram_Safety.SchDoc]

### Notes on the sheet
- Conceptual name:
- Type:
- Signal source -> sink:
- Voltage:
- Signal path/name:
- 5x Output_Enable (PILOT_OUT)
- 1x CarrierRdy
- 5x !FLT
- 5x OE
- 1x FLT (Safe State Request; e.g., External Stop)
- Per-Dx
- Shared
- S³C -> Slot-Ctrl.
- S³C -> Slot-Conn.
- Slot-Ctrl. -> S³C
- 3V3
- 1V8
- DIG_S3C.Shared.ReqSafeState
- DIG_S3C.Shared.CarrierReady
- DIG_S3C.SlotDi.SlotOE
- DIG_S3C.SlotDi.SlotOK
- DIG_S3C.SlotDi.ReqOE
- (PILOT_IN; becomes FLT after fusion in slot c.)
- (Local)
- Slot-Conn. -> Slot-Ctrl.
- (PILOT_INi and /PILOT_INi?)
- Output_Enable (PILOT_OUT)
- CarrierRdy
- FLT
- !FLT
- System Controller (S³C)     -     The Overview...
  ‾‾‾‾‾‾‾‾‾‾‾‾‾‾‾‾‾‾‾‾‾‾‾‾‾‾‾‾‾‾‾
  - CPLD (Mach XO2): @{"Id":"SQFYHMDP\GDKKGAXW","ObjectType":2}
  - Supply (3V3_S3C): @{"Id":"WRUMMABL\FKHMQCER","ObjectType":2}C via @{"Id":"TLQAQFSU\MEVMZYQD","ObjectType":2}/@{"Id":"TLQAQFSU\IEVRLGJR","ObjectType":2} or @{"Id":"TLQAQFSU\LYBHNRUZ","ObjectType":2}
  - S³C banks on 3V3: @{"Id":"WLJBPXCV\XKYOFSKT","ObjectType":2} / @{"Id":"WLJBPXCV\VUOVJWPJ","ObjectType":2} / @{"Id":"WLJBPXCV\PWEMKMAC","ObjectType":2}
  - S³C banks on 1V8: @{"Id":"IHIVEANZ\VYMJOBVW","ObjectType":2} / @{"Id":"IHIVEANZ\NPRHXGHB","ObjectType":2} / @{"Id":"IHIVEANZ\YWWFRIZR","ObjectType":2}
  Auxiliary circuitry (for D-slot-shared interfaces):
  - JTAG multiplexing between S³C and Dx: @{"Id":"LGRAAJOA\GWKTDCTA","ObjectType":2}
  - CS generation of PS-SPI0 (same targets): @{"Id":"KLVSJJVY\JYUMMZGZ","ObjectType":2}
  Sequencing- and safety-related remarks:
  - The card-driven "OK" signal (PILOT_IN) plus
  the slot controller's internal state (de)assert OE
  - The S³C receives 1 OE per slot, ANDs it with its
  internal state, and sets per-slot "OE"s (_OUT)
- OE
- Power Supply Supervisors
  (@{"Id":"TEECNEDB\YDIXTMEQ","ObjectType":2}A/B)
- D1-Slot Controller
- D2-Slot Controller
- D3-Slot Controller
- D4-Slot Controller
- D5-Slot Controller
- External Stop
- 2x
- PILOT_IN
- SoC
- D1-Slot
- D2-Slot
- D3-Slot
- D4-Slot
- D5-Slot
- Title
- Revision:
- Design Engineer:
- Date:
- Project:
- Sheet
- of

## Sheet S3C_SupplyAndMonitoring.SchDoc
size A4; Organization: UltraZohm; SheetNumber: 24
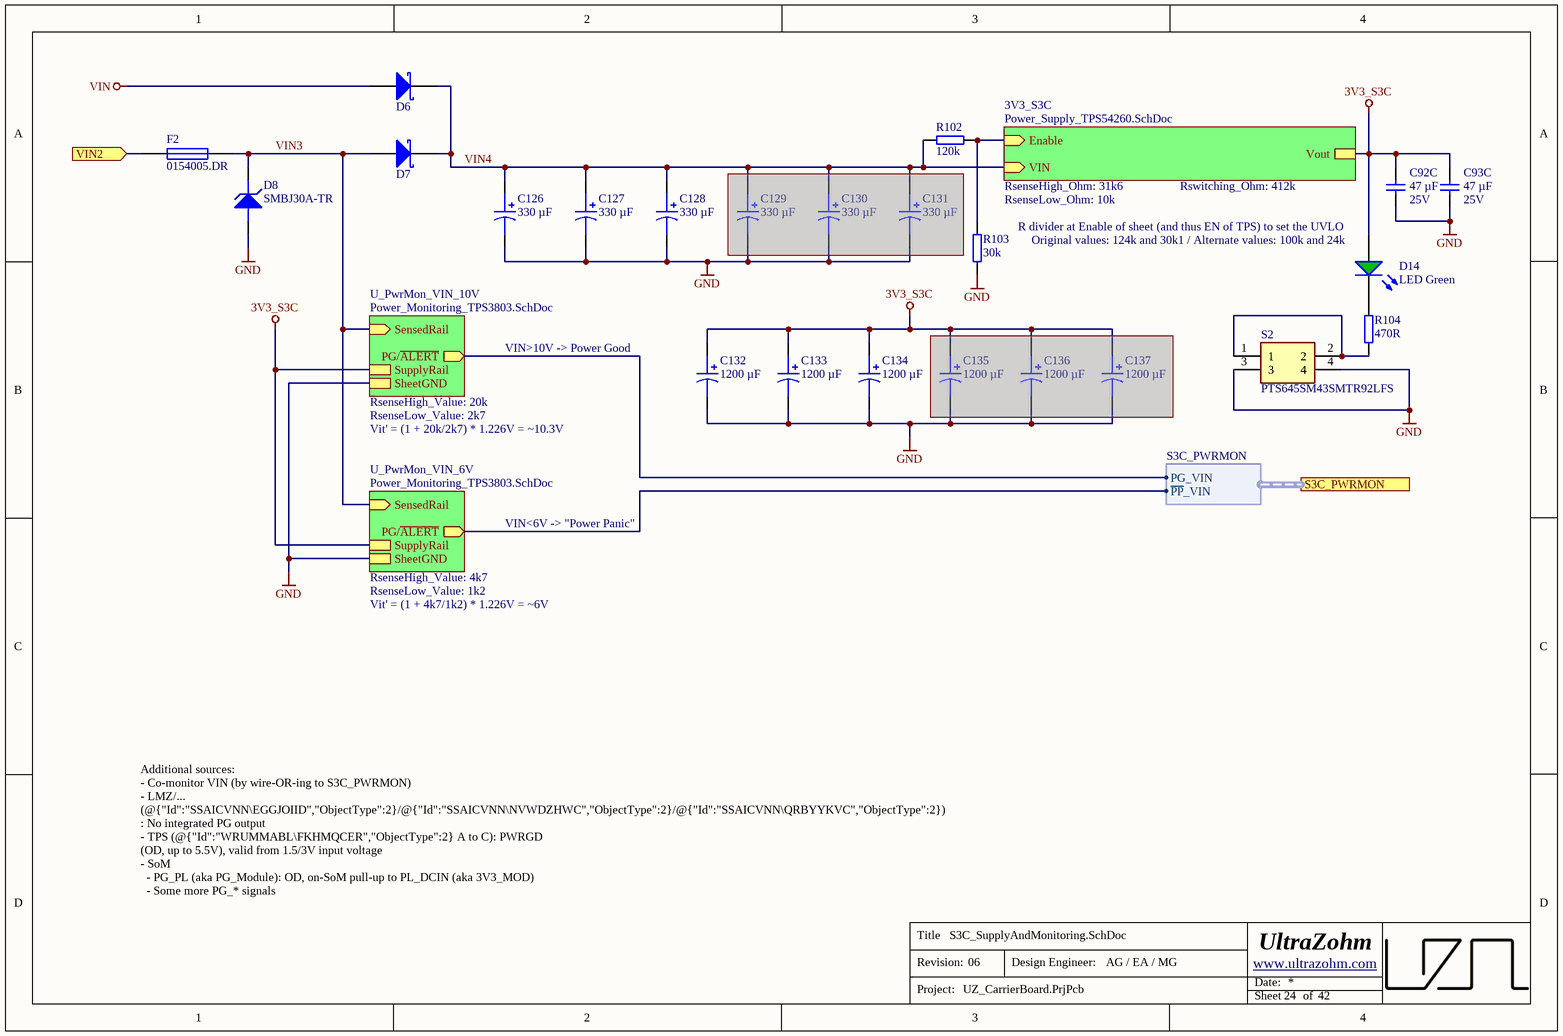
[diagram p34: S3C_SupplyAndMonitoring.SchDoc]

### Parts
C92C  47 µF  Voltage: 25V  [C_1206_TE]
C93C  47 µF  Voltage: 25V  [C_1206_TE]
C126  330 µF  [CAPAE1050X1250N]
C127  330 µF  [CAPAE1050X1250N]
C128  330 µF  [CAPAE1050X1250N]
C129  330 µF  [CAPAE1050X1250N]  (masked out: inside a compile mask, not in the netlist)
C130  330 µF  [CAPAE1050X1250N]  (masked out: inside a compile mask, not in the netlist)
C131  330 µF  [CAPAE1050X1250N]  (masked out: inside a compile mask, not in the netlist)
C132  1200 µF  [CAPAE1050X1250N]
C133  1200 µF  [CAPAE1050X1250N]
C134  1200 µF  [CAPAE1050X1250N]
C135  1200 µF  [CAPAE1050X1250N]  (masked out: inside a compile mask, not in the netlist)
C136  1200 µF  [CAPAE1050X1250N]  (masked out: inside a compile mask, not in the netlist)
C137  1200 µF  [CAPAE1050X1250N]  (masked out: inside a compile mask, not in the netlist)
D6  40V  [DIOM5226X262N]  (value not drawn)
D7  40V  [DIOM5226X262N]  (value not drawn)
D8  SMBJ30A-TR  [DIOM5436X244N]
D14  LED Green  [WL-SMCW_0603]
F2  0154005.DR  [Littlefuse_154]
R102  120k  [R_0603_TE]
R103  30k  [R_0603_TE]
R104  470R  [R_0603_TE]
S2  PTS645SM43SMTR92LFS  [PTS645_SMT]

### Sub-sheets
3V3_S3C = Power_Supply_TPS54260.SchDoc: Vout, Enable (in), VIN (in)  | RsenseHigh_Ohm: 31k6; RsenseLow_Ohm: 10k; Rswitching_Ohm: 412k; SubSheet_SheetNumber: 25; Output_V: 3.3
U_PwrMon_VIN_6V = Power_Monitoring_TPS3803.SchDoc: SensedRail (in), PG/~{ALERT} (out), SupplyRail, SheetGND  | RsenseHigh_Value: 4k7; RsenseLow_Value: 1k2; SubSheet_SheetNumber: 26.1
U_PwrMon_VIN_10V = Power_Monitoring_TPS3803.SchDoc: SensedRail (in), PG/~{ALERT} (out), SupplyRail, SheetGND  | RsenseHigh_Value: 20k; RsenseLow_Value: 2k7; SubSheet_SheetNumber: 26.2

### Ports
S3C_PWRMON (harness S3C_PWRMON), VIN2 (in)

### Harnesses
S3C_PWRMON: PG_VIN, ~{PP}_VIN

### Nets
3V3_S3C: C92C.2 C93C.2 C132.1 C133.1 C134.1 D14.2(A) ; sheet 3V3_S3C/Vout, sheet U_PwrMon_VIN_10V/SupplyRail, sheet U_PwrMon_VIN_6V/SupplyRail
GND: C92C.1 C93C.1 C126.2 C127.2 C128.2 C132.2 C133.2 C134.2 D8.2(ANODE) R103.1 S2.3 S2.4 ; sheet U_PwrMon_VIN_10V/SheetGND, sheet U_PwrMon_VIN_6V/SheetGND
VIN: D6.2(A)
Enable: R102.2 R103.2 ; sheet 3V3_S3C/Enable
PG/~{ALERT}: sheet U_PwrMon_VIN_10V/PG/~{ALERT}, port S3C_PWRMON.PG_VIN
PG/~{ALERT}: sheet U_PwrMon_VIN_6V/PG/~{ALERT}, port S3C_PWRMON.~{PP}_VIN  [a separate net that carries the same name]
VIN2: F2.1 ; port VIN2
VIN3: D7.2(A) D8.1(KATHODE) F2.2 ; sheet U_PwrMon_VIN_10V/SensedRail, sheet U_PwrMon_VIN_6V/SensedRail
VIN4: C126.1 C127.1 C128.1 D6.1(K) D7.1(K) R102.1 ; sheet 3V3_S3C/VIN
NetD14_1: D14.1(K) R104.2
NetR104_1: R104.1 S2.1 S2.2

### Notes on the sheet
- R divider at Enable of sheet (and thus EN of TPS) to set the UVLO
- (near D14) Original values: 124k and 30k1 / Alternate values: 100k and 24k
- VIN>10V -> Power Good
- Vit' = (1 + 20k/2k7) * 1.226V = ~10.3V
- VIN<6V -> "Power Panic"
- Vit' = (1 + 4k7/1k2) * 1.226V = ~6V
- Additional sources:
  - Co-monitor VIN (by wire-OR-ing to S3C_PWRMON)
  - LMZ/... (@{"Id":"SSAICVNN\EGGJOIID","ObjectType":2}/@{"Id":"SSAICVNN\NVWDZHWC","ObjectType":2}/@{"Id":"SSAICVNN\QRBYYKVC","ObjectType":2}) : No integrated PG output
  - TPS (@{"Id":"WRUMMABL\FKHMQCER","ObjectType":2} A to C): PWRGD (OD, up to 5.5V), valid from 1.5/3V input voltage
  - SoM
  - PG_PL (aka PG_Module): OD, on-SoM pull-up to PL_DCIN (aka 3V3_MOD)
  - Some more PG_* signals
  - PLL_LOLn
- Title
- Revision:
- Design Engineer:
- Date:
- Project:
- Sheet
- of

### Library data of the parts
C92C C93C = UZgen_C_1206_47uF_25V_X7R: Generic capacitor; Manufacturer: UZgen; Tolerance: 10 %; Created from: MGeier; Value: 47 µF; Technology: X7R; Manufacturer Part Number: UZgen_C_1206_47uF_25V_X7R; PartID: 5224; Created On: 02/08/2024 11:18:30; Device Package: 1206; Mounting Type: SMD; Last Updated: 02/08/2024 15:18:55
C126-C131 = EEEFT1H331GP: Aluminium Electrolytic Capacitors - SMD 330uF 50V; Manufacturer: Panasonic; Tolerance: 20 %; Voltage Rating: 50 VDC; Created from: FRosner; Manufacturer Part Number: EEEFT1H331GP; PartID: 163; Created On: 05/09/2024 09:08:02; ComponentLink1Description: Datasheet; ComponentLink1URL: https://www.mouser.de/datasheet/2/315/ABA0000C1240-1130326.pdf; Component Type: Aluminium Electrolytic; Device Package: 10 mm; Last Updated: 05/10/2024 13:28:45; Mounting Type: SMD; Operating Temperature: -55 to +105°C; Series: FT; Supplier 1: Mouser; Supplier Part Number 1: 667-EEE-FT1H331GP; Supplier 2: LCSC; Supplier Part Number 2: C542207; Type: Capacitor; Value: 330 µF; Live Cycle Status: 1; LCSC Part Number: C542207
C132-C137 = EEE-FPA122UAP: Aluminium Electrolytic Capacitors - SMD 1200uF 10V; Manufacturer: Panasonic; Tolerance: 20 %; Voltage Rating: 10 VDC; Created from: FRosner; Manufacturer Part Number: EEE-FPA122UAP; PartID: 162; Created On: 05/09/2024 09:12:47; ComponentLink1Description: Datasheet; ComponentLink1URL: https://www.mouser.de/datasheet/2/315/ABA0000C1184-947404.pdf; Component Type: Aluminium Electrolytic; Device Package: 10 mm; Last Updated: 05/10/2024 13:28:46; Mounting Type: SMD; Operating Temperature: -55 to +105°C; Series: FP; Supplier 1: Mouser; Supplier Part Number 1: 667-EEE-FPA122UAP; Supplier 2: LCSC; Supplier Part Number 2: C401755; Type: Capacitor; Value: 1200 µF; Live Cycle Status: 1; LCSC Part Number: C401755
D6 D7 = SS14: Schottky Diode, 40 V, 1 A; MPN: BYS12-90-E3/TR3; Manufacturer Part Number: SS14; Manufacturer: onsemi; MF: Vishay; Forward Voltage: 0.5 V; Reverse Voltage: 90V; Rated Current: 1.5A; Forward Current: 1 A; Reverse Current: 10 mA; Created from: MGeier; Package: DO-214AC; Supplier 1: LCSC; Supplier 2: Mouser; Supplier 3: Digi-Key; Supplier Part Number 1: C83852; Supplier Part Number 2: 625-BYS12-90-E3/TR3; Supplier Part Number 3: BYS12-90-E3/GICT-ND; PartID: 14; Created On: 05/04/2024 16:08:36; ComponentLink1Description: Datasheet; ComponentLink1URL: https://wmsc.lcsc.com/wmsc/upload/file/pdf/v2/lcsc/1809291420_onsemi-SS14_C83852.pdf; Component Type: Schottky Diode; Device Package: SMA (DO-214AC); Last Updated: 22/08/2024 08:31:16; Mounting Type: SMD; Operating Temperature: -65 to +125 °C; Type: Schottky Diode; Value: 40V; Live Cycle Status: 1; LCSC Part Number: C83852; Stock number: not stored
D8 = SMBJ30A-TR: as D23 on sheet Power_Supply_Input; Manufacturer Part Number: SMBJ30A-TR; PartID: 19; Created On: 05/03/2021 11:12:07; ComponentLink1Description: Datasheet; ComponentLink1URL: https://www.st.com/resource/en/datasheet/smbj30a.pdf; Component Type: TVS Diode; Device Package: DO-214AA-2; Last Updated: 23/07/2025 19:13:45; Mounting Type: SMD; Operating Temperature: -55 - 150°C; Series: SMBJxxA; Supplier 1: LCSC; Supplier Part Number 1: C133663; Value: 30V; Live Cycle Status: 1; LCSC Part Number: C133663
D14 = UZgen_LED_0603_Green: as D10 on sheet Power_Supply_1; Manufacturer Part Number: UZgen_LED_0603_Green; PartID: 21; Created On: 09/09/2024 10:45:01; ComponentLink1Description: N/A; ComponentLink1URL: N/A; Component Type: LED Diode; Device Package: 0603; Last Updated: 09/09/2024 10:45:01; Mounting Type: SMD; Supplier 1: LCSC; Supplier Part Number 1: =LCSC Part Number; Type: Standard; Value: LED Green; Live Cycle Status: 1; Stock number: not stored; Color: green
F2 = 0154005.DR: as F1 on sheet Power_Supply_Input; Manufacturer Part Number: 0154005.DR; PartID: 1; Created On: 07/01/2021 10:17:19; ComponentLink1Description: Datasheet; ComponentLink1URL: https://www.mouser.de/datasheet/2/240/Littelfuse_Fuse_154_154T_154L_154TL_Datasheet_pdf-365375.pdf; Component Type: NAN02 - 154 OMNI-BLOK; Device Package: OMNI-BLOK; Last Updated: 04/09/2024 15:44:00; Mounting Type: SMD; Operating Temperature: -55 - 125 °C; Series: 154; Supplier 1: Mouser; Supplier Part Number 1: 576-0154005.DR; Type: Fuse; Live Cycle Status: 1; Supplier 2: LCSC; Supplier Part Number 2: C206916; LCSC Part Number: C206916
R102 = UZgen_R_0603_120k: Generic resistor; Manufacturer: UZgen; Tolerance: 1 %; Created from: UZgenTool; Manufacturer Part Number: UZgen_R_0603_120k; PartID: 270; Created On: 02/07/2024 17:29:50; Value: 120k; Device Package: 0603; Mounting Type: SMD; Last Updated: 02/07/2024 17:29:50
R103 = UZgen_R_0603_30k: Generic resistor; Manufacturer: UZgen; Tolerance: 1 %; Created from: UZgenTool; Manufacturer Part Number: UZgen_R_0603_30k; PartID: 255; Created On: 02/07/2024 17:29:50; Value: 30k; Device Package: 0603; Mounting Type: SMD; Last Updated: 02/07/2024 17:29:50
R104 = UZgen_R_0603_470R: Generic resistor; Manufacturer: UZgen; Tolerance: 1 %; Created from: UZgenTool; Manufacturer Part Number: UZgen_R_0603_470R; PartID: 213; Created On: 02/07/2024 17:29:49; Value: 470R; Device Package: 0603; Mounting Type: SMD; Last Updated: 02/07/2024 17:29:49
S2 = PTS645SM43SMTR92LFS: as S1 on sheet S3C_IOs3V3; Datasheet Link: https://www.ckswitches.com/media/1471/pts645.pdf; Manufacturer_Part_Number: PTS645SM43SMTR92LFS; Mouser Part Number: 611-PTS645SM43SMTR92; Mouser Price/Stock: https://www.mouser.co.uk/ProductDetail/CK/PTS645SM43SMTR92LFS?qs=FESYatJ8odKPktxv6ncfWg%3D%3D; Arrow Part Number: PTS645SM43SMTR92LFS; Arrow Price/Stock: https://www.arrow.com/en/products/pts645sm43smtr92lfs/ck; Manufacturer Part Number: PTS645SM43SMTR92LFS; PartID: 24; Created On: 31/05/2023 15:31:02; ComponentLink1Description: Datasheet; ComponentLink1URL: https://datasheet.lcsc.com/lcsc/1810121628_C-K-PTS645SM43SMTR92LFS_C221880.pdf; Component Type: Tactile Switch; Device Package: SMD; Last Updated: 31/05/2023 15:31:02; Mounting Type: SMD; Operating Temperature: -20 to +60 °C; Supplier 1: Mouser; Supplier Part Number 1: 611-PTS645SM43SMTR92; Supplier 2: LCSC; Supplier Part Number 2: C221880; Type: Tactile Switch; Live Cycle Status: 1; LCSC Part Number: C221880

## Sheet Power_Monitoring_TPS3803.SchDoc
size A4; Organization: UltraZohm; SheetNumber: 24; SheetTotal: 40
Used 2 times, as channels U_S3C_SupplyAndMonitoring/U_PwrMon_VIN_10V, U_S3C_SupplyAndMonitoring/U_PwrMon_VIN_6V. Parts and nets are listed once, with the designators drawn on the sheet.
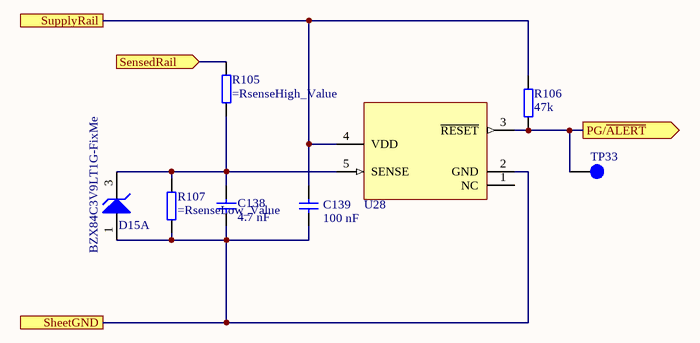
[diagram p35: Power_Monitoring_TPS3803.SchDoc]

### Parts
C138  4.7 nF  [C_0603_TE]
C139  100 nF  [C_0603_TE]
D15  BZX84C3V9LT1G-FixMe  [SOT-23-3_ONSC]  (part A of 2)
R105  (no value)  [R_0603_TE]
R106  47k  [R_0603_TE]
R107  (no value)  [R_0603_TE]
TP33  Testpoint 1mm  [TP_1mm]  (value not drawn)  (no BOM)
U28  TPS3803-01QDCKRQ1  [FP-DCK0005A-IPC_B]  (value not drawn)

### Ports
PG/~{ALERT} (out), SensedRail (in), SheetGND, SupplyRail

### Nets
PG/~{ALERT}: R106.1 TP33.1 U28.3(~{RESET}) ; port PG/~{ALERT}
SensedRail: R105.2 ; port SensedRail
SheetGND: C138.2 C139.1 D15.1(A) R107.1 U28.2(GND) ; port SheetGND
SupplyRail: C139.2 R106.2 U28.4(VDD) ; port SupplyRail
NetC138_1: C138.1 D15.3(K) R105.1 R107.2 U28.5(SENSE)

Not connected (* = marked no-connect by the designer): U28 1(NC)

### Channels
U_S3C_SupplyAndMonitoring/U_PwrMon_VIN_10V: designators end in A; ports PG/~{ALERT}=PG/~{ALERT} SensedRail=VIN3 SheetGND=GND SupplyRail=3V3_S3C
U_S3C_SupplyAndMonitoring/U_PwrMon_VIN_6V: designators end in B; ports PG/~{ALERT}=PG/~{ALERT} SensedRail=VIN3 SheetGND=GND SupplyRail=3V3_S3C

### Notes on the sheet
- Title
- Revision:
- Design Engineer:
- Date:
- Project:
- Sheet
- of

### Library data of the parts
C138 = GRM1885C1H472JA01D: as C94 on sheet Power_Supply_TPS54260; Tolerance: 5%; Value: 4.7 nF; Manufacturer Part Number: GRM1885C1H472JA01D; PartID: 153; Created On: 02/08/2024 16:00:00; ComponentLink1Description: Datasheet; ComponentLink1URL: https://wmsc.lcsc.com/wmsc/upload/file/pdf/v2/lcsc/2304140030_Murata-Electronics-GRM1885C1H472JA01D_C85980.pdf; Component Type: Capacitor 0603; Device Package: 0603; Last Updated: 02/08/2024 16:00:00; Mounting Type: SMD; Operating Temperature: –55 to 125°C; Series: GRM (Chip Multilayer Ceramic Capacitors for General Purpose); Supplier 1: LCSC; Supplier Part Number 1: C85980; Type: Capacitor; Voltage Rating: 50 V; Live Cycle Status: 1; LCSC Part Number: C85980; Stock number: not stored
C139 = UZgen_C_0603_100nF_50V_X7R: as C118 on sheet S3C_SplitSPI; Manufacturer Part Number: UZgen_C_0603_100nF_50V_X7R; PartID: 1; Created On: 02/07/2024 14:42:23; Value: 100 nF; Device Package: 0603; Technology: X7R; Mounting Type: SMD; Last Updated: 08/08/2024 15:01:15
D15 = BZX84C3V9LT1G-FixMe: Zener Diode, 3.9 V, 0.25 W, 5 %; Manufacturer: onsemi; Power Loss: 250 mW; Zener Impedance: 60 Ohm; Value: 3.9V; Created from: FRosner; Manufacturer Part Number: BZX84C3V9LT1G-FixMe; PartID: 19; Created On: 20/11/2024 13:34:23; ComponentLink1Description: Datasheet; ComponentLink1URL: https://www.lcsc.com/datasheet/lcsc_datasheet_2304140030_onsemi-BZX84C3V9LT1G_C94414.pdf; Component Type: Zener Diode; Device Package: SOT-23-3; Last Updated: 20/11/2024 13:33:19; Mounting Type: SMD; Operating Temperature: -65 - 150 °C; Series: BZX84C3V9L; Supplier 1: LCSC; Supplier Part Number 1: C94414; Type: Zener Diode; Live Cycle Status: 1; LCSC Part Number: C94414; Stock number: not stored
R105 R107 = UZgen_R_0603_ParaR: as R141 on sheet Power_Supply_TPS54260; PartID: 588; Created On: 08/07/2024 14:34:30; Device Package: 0603; Mounting Type: SMD; Last Updated: 08/07/2024 14:34:30
  R105: Manufacturer Part Number: =RsenseHigh_MPN; Value: =RsenseHigh_Value
  R107: Manufacturer Part Number: =RsenseLow_MPN; Value: =RsenseLow_Value
R106 = UZgen_R_0603_47k: as R172 on sheet Power_Supply_Input; Manufacturer Part Number: UZgen_R_0603_47k; PartID: 260; Created On: 02/07/2024 17:29:50; Value: 47k; Device Package: 0603; Mounting Type: SMD; Last Updated: 02/07/2024 17:29:50
TP33 = NULL: as TP78 on sheet Power_Supply_TPS54260; Created: 2018_06_25_AGeiger; Value: Testpoint 1mm; PartID: 9; Created On: 20/09/2022 13:14:57; Component Type: Testpoint; Last Updated: 20/09/2022 13:15:39; Manufacturer: NULL; Supplier 1: NULL; Supplier Part Number 1: NULL; Type: Testpoint; Live Cycle Status: 1
U28 = TPS3803-01QDCKRQ1: Supervisory Circuits Auto Cat Dual Vltg Detectors; Manufacturer: Texas Instruments; Created from: FRosner; Manufacturer Part Number: TPS3803-01QDCKRQ1; PartID: 6; Created On: 12/07/2024 08:21:41; ComponentLink1Description: Datasheet; ComponentLink1URL: https://www.ti.com/lit/ds/symlink/tps3803-q1.pdf?ts=1720723571308&ref_url=https%253A%252F%252Fwww.mouser.com%252F; Component Type: Supervisory Circuits; Device Package: SC-70; Last Updated: 04/10/2024 21:14:00; Mounting Type: SMD; Operating Temperature: -40 to +125 °C; Series: TPS3803-Q1; Supplier 1: Mouser; Supplier Part Number 1: 595-TPS380301QDCKRQ1; Supplier 2: LCSC; Supplier Part Number 2: C129371; Value: TPS3803-01QDCKRQ1; LCSC Part Number: C129371